# EAGLE board escape (EAGLE 9.5.1)
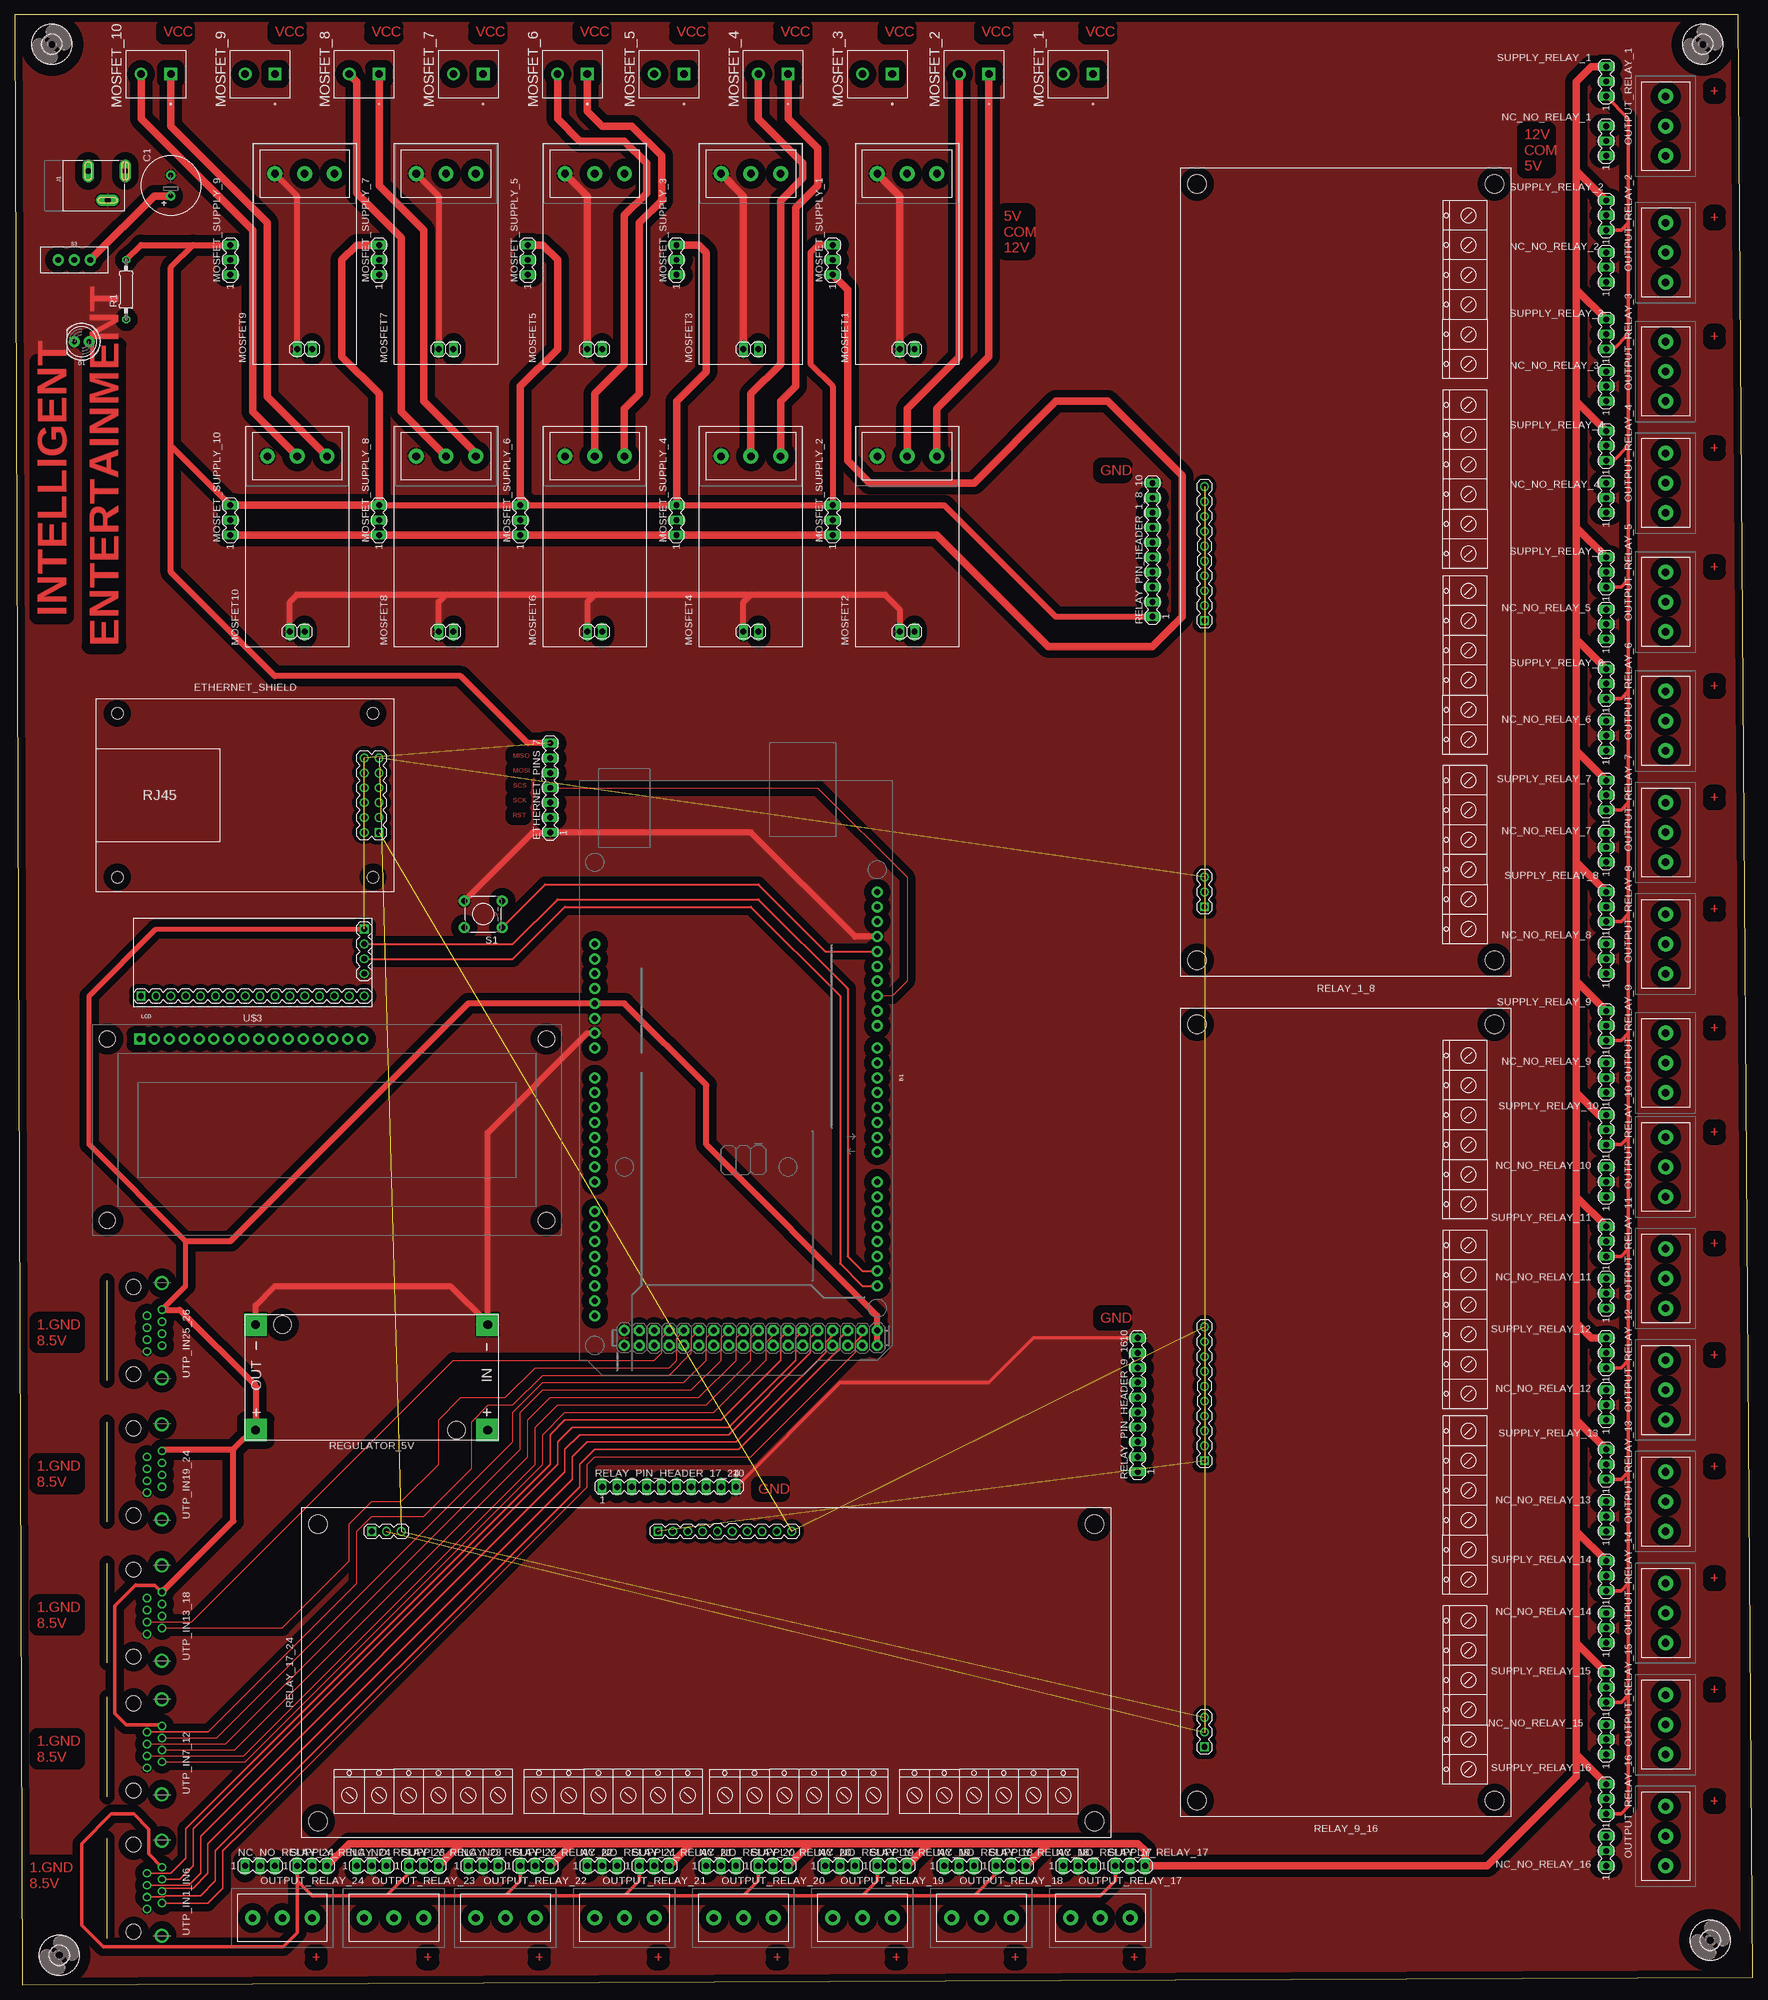
[diagram p5: board, top side]
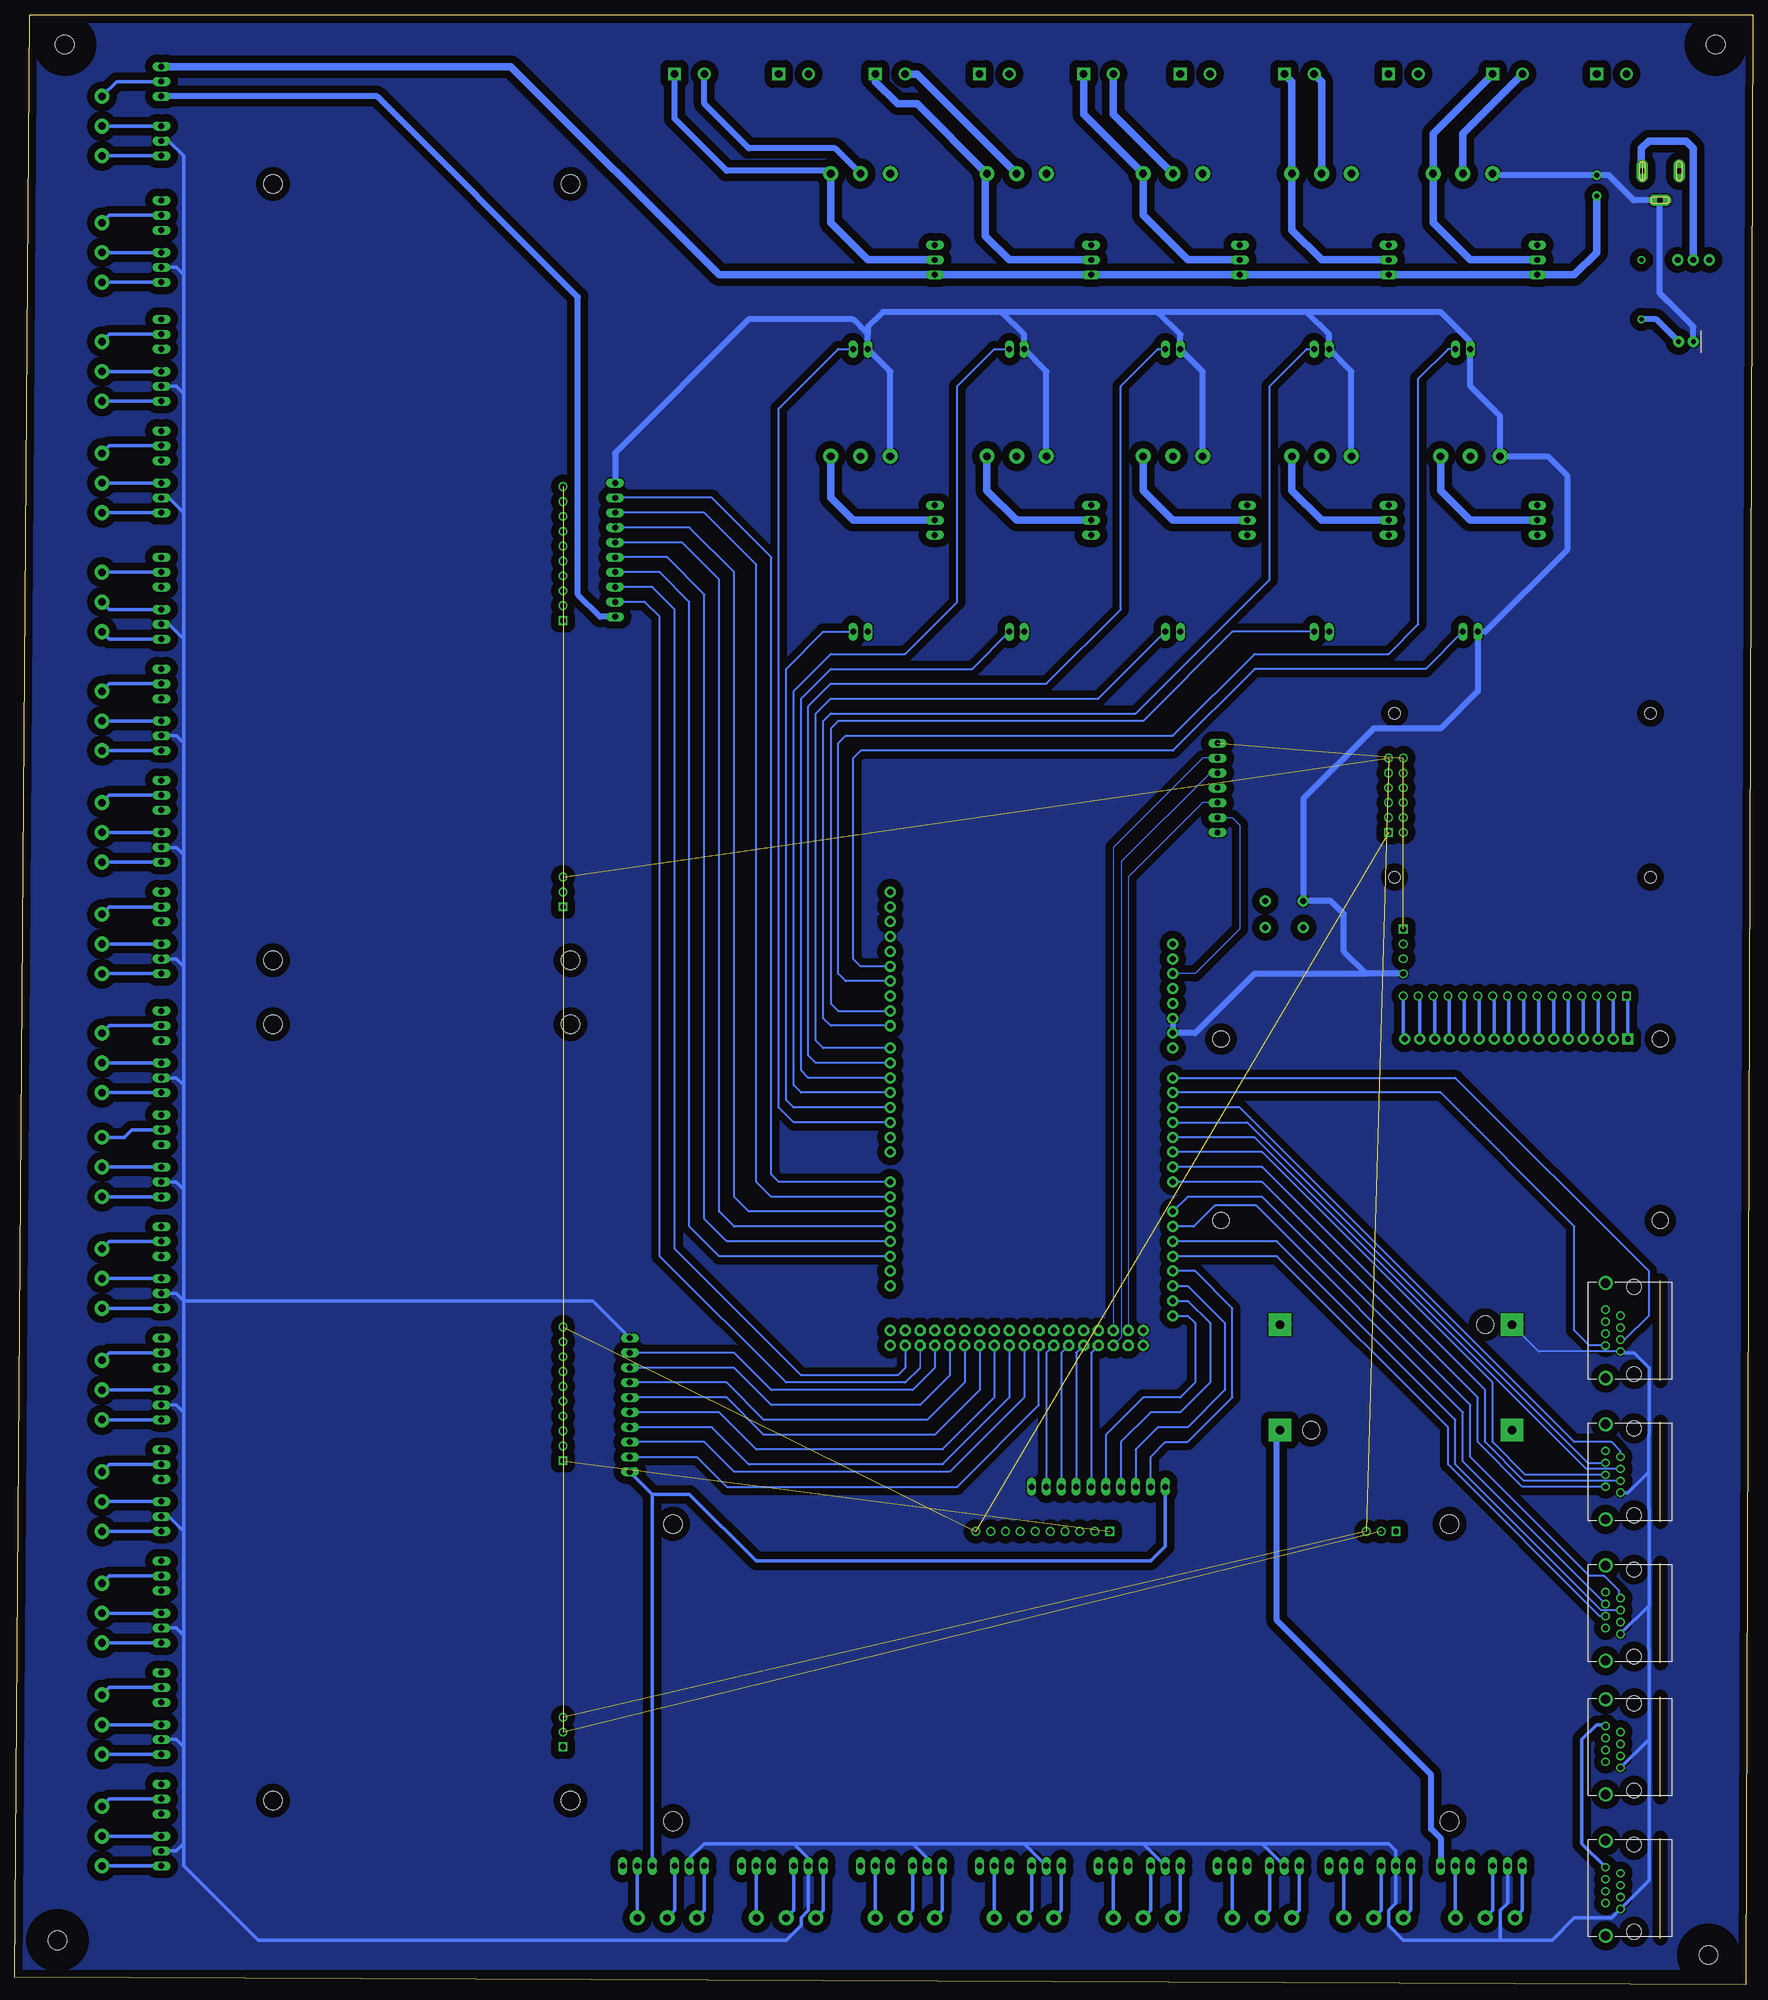
[diagram p6: board, bottom side, seen from below]

Size 296.85 x 336.54 mm. Coordinates in mm from the lower left corner, seen from the top.
Outline: 1.27,0 296.85,1.27 294.31,336.54 0,336.54 1.27,0
Copper layers (1*16): Top 0.035mm / dielectric 1.5mm / Bottom 0.035mm
Design rules "default": minimum track width 6mil, minimum drill 0.35mm, track to track 6mil, track to pad 6mil, pad to pad 6mil, via to via 6mil, smd to smd 6mil, copper to edge 40mil, drill to drill 6mil, minimum pad ring 10mil, minimum via ring 8mil, stop-mask expansion 4mil, vias tented up to drill 0mil, thermal gap 10mil

## Footprints (pad centres in the part's own frame; a part is rotated, then mirrored left to right if it is on the bottom)
ARDUINO_MEGA_NO_SILK = drill 1.016 pad 1.88: 0 13.97,24.13; 1 11.43,24.13; 2 8.89,24.13; 3 6.35,24.13; 3.3V -13.97,-24.13; 4 3.81,24.13; 5 1.27,24.13; 5V -11.43,-24.13; 5V@1 44.45,24.13; 5V@2 46.99,24.13; 6 -1.27,24.13; 7 -3.81,24.13; 8 -7.62,24.13; 9 -10.16,24.13; 10 -12.7,24.13; 11 -15.24,24.13; 12 -17.78,24.13; 13 -20.32,24.13; 14 19.05,24.13; 15 21.59,24.13; 16 24.13,24.13; 17 26.67,24.13; 18 29.21,24.13; 19 31.75,24.13; 20 34.29,24.13; 21 36.83,24.13; A0 1.27,-24.13; A1 3.81,-24.13; A2 6.35,-24.13; A3 8.89,-24.13; A4 11.43,-24.13; A5 13.97,-24.13; A6 16.51,-24.13; A7 19.05,-24.13; A8 24.13,-24.13; A9 26.67,-24.13; A10 29.21,-24.13; A11 31.75,-24.13; A12 34.29,-24.13; A13 36.83,-24.13; A14 39.37,-24.13; A15 41.91,-24.13; AREF -25.4,24.13; GND -8.89,-24.13; GND@1 -6.35,-24.13; GND@2 44.45,-19.05; GND@3 46.99,-19.05; GND@4 -22.86,24.13; IOREF -19.05,-24.13; NC -21.59,-24.13; RESET -16.51,-24.13; SCL -30.48,24.13; SDA -27.94,24.13; VIN -3.81,-24.13 | drill 1.016 pad 1.88 octagon: 22 44.45,21.59; 23 46.99,21.59; 24 44.45,19.05; 25 46.99,19.05; 26 44.45,16.51; 27 46.99,16.51; 28 44.45,13.97; 29 46.99,13.97; 30 44.45,11.43; 31 46.99,11.43; 32 44.45,8.89; 33 46.99,8.89; 34 44.45,6.35; 35 46.99,6.35; 36 44.45,3.81; 37 46.99,3.81; 38 44.45,1.27; 39 46.99,1.27; 40 44.45,-1.27; 41 46.99,-1.27; 42 44.45,-3.81; 43 46.99,-3.81; 44 44.45,-6.35; 45 46.99,-6.35; 46 44.45,-8.89; 47 46.99,-8.89; 48 44.45,-11.43; 49 46.99,-11.43; 50 44.45,-13.97; 51 46.99,-13.97; 52 44.45,-16.51; 53 46.99,-16.51
E3,5-10 = drill 0.813 pad 1.6: + -1.778,0 | drill 0.813 pad 1.6 octagon: - 1.778,0
LED_5MM = drill 0.813 pad 1.88: A -1.27,0; K 1.27,0
MA07-1 = drill 1.016 long: 1 -7.62,0; 2 -5.08,0; 3 -2.54,0; 4 0,0; 5 2.54,0; 6 5.08,0; 7 7.62,0
ETHERNET-ENC28J60 = drill 1 square: 1 22.86,-6.35 | drill 1: 2 20.32,-6.35; 3 22.86,-3.81; 4 20.32,-3.81; 5 22.86,-1.27; 6 20.32,-1.27; 7 22.86,1.27; 8 20.32,1.27; 9 22.86,3.81; 10 20.32,3.81; 11 22.86,6.35; 12 20.32,6.35 | hole 2: -21.844,13.97; 21.844,13.97; -21.844,-13.97; 21.844,-13.97
POWER_JACK_SLOT = drill 1 pad 2 long: GND@1 2.58,7.5; GND@2 7.58,10.8; PWR 2.58,13.8
LCD-16X2_NOSILK = drill 1.016 pad 1.88 square: 1 -32,15.5 | drill 1.016 pad 1.88: 2 -29.46,15.5; 3 -26.92,15.5; 4 -24.38,15.5; 5 -21.84,15.5; 6 -19.3,15.5; 7 -16.76,15.5; 8 -14.22,15.5; 9 -11.68,15.5; 10 -9.14,15.5; 11 -6.6,15.5; 12 -4.06,15.5; 13 -1.52,15.5; 14 1.02,15.5; 15 3.56,15.5; 16 6.1,15.5 | hole 2.8: -37.5,15.5; -37.5,-15.5; 37.5,15.5; 37.5,-15.5
SAMACSYS_PARTS_FR120N-ISOLATED-MOSFET-MOD = drill 1.016 long: 1 2.54,7.62; 2 2.54,10.16 | drill 1.3 pad 2.54: 3 32.512,3.81; 4 32.512,8.89; 5 32.512,13.97
TB006-508-02BE_CUI_TB006-508-02BE = drill 1.3 pad 2.184 square: 1 0,0 | drill 1.3 pad 2.184: 2 5.08,0
MA03-1 = drill 1.016 long: 1 -2.54,0; 2 0,0; 3 2.54,0
SAMACSYS_PARTS_TB00650803BE = drill 1.3 pad 2.54: 1 0,0; 2 5.08,0; 3 10.16,0
0207/10 = drill 0.813 octagon: 1 -5.08,0; 2 5.08,0
DIY-MODULES_DC-DC-STEP-DOWN-LM2596 = drill 1.5 pad 3.81 square: IN+ -19.812,9.398; IN- -19.812,-8.636; OUT+ 19.812,9.398; OUT- 19.812,-8.636 | hole 3: -14.478,9.398; 15.24,-8.636
RELAY-8-SRD = drill 1 square: J1.1 24.13,8.255; J2.1 24.13,57.15 | drill 1: J1.2 24.13,5.715; J1.3 24.13,3.175; J1.4 24.13,0.635; J1.5 24.13,-1.905; J1.6 24.13,-4.445; J1.7 24.13,-6.985; J1.8 24.13,-9.525; J1.9 24.13,-12.065; J1.10 24.13,-14.605; J2.2 24.13,54.61; J2.3 24.13,52.07 | hole 3.2: -25.4,66.294; 25.4,66.294; 25.4,-66.294; -25.4,-66.294
MA10-1 = drill 1.016 long: 1 -11.43,0; 2 -8.89,0; 3 -6.35,0; 4 -3.81,0; 5 -1.27,0; 6 1.27,0; 7 3.81,0; 8 6.35,0; 9 8.89,0; 10 11.43,0
TACTILE-PTH = drill 1.016 pad 1.88: 1 -3.251,2.261; 2 3.251,2.261; 3 -3.251,-2.261; 4 3.251,-2.261
SWITCH_SPDT_PTH_11.6X4.0MM_LOCK = drill 1.016 pad 1.88: 1 0,2.718; 2 0,0; 3 0,-2.718
3,2 = hole 3.2: 0,0
LCD-I2C-CONVERTER = drill 1 square: J1.1 -19.05,-5.08; J2.1 19.05,6.35 | drill 1: J1.2 -19.05,-2.54; J1.3 -19.05,0; J1.4 -19.05,2.54; J2.2 16.51,6.35; J2.3 13.97,6.35; J2.4 11.43,6.35; J2.5 8.89,6.35; J2.6 6.35,6.35; J2.7 3.81,6.35; J2.8 1.27,6.35; J2.9 -1.27,6.35; J2.10 -3.81,6.35; J2.11 -6.35,6.35; J2.12 -8.89,6.35; J2.13 -11.43,6.35; J2.14 -13.97,6.35; J2.15 -16.51,6.35; J2.16 -19.05,6.35
GLX-S-88M = drill 0.9 pad 1.422: 1 -3.57,-2.3; 2 -2.55,-4.84; 3 -1.53,-2.3; 4 -0.51,-4.84; 5 0.51,-2.3; 6 1.53,-4.84; 7 2.55,-2.3; 8 3.57,-4.84 | drill 1.6 pad 2.184: S1 -8.125,-4.84; S2 8.125,-4.84 | hole 2.55: -7.44,0; 7.44,0

## Placement (x,y rotation side)
B1  ARDUINO_MEGA_R3FULL  [ARDUINO_MEGA_NO_SILK]  123.19,156.21 270 top
C1  [E3,5-10]  26.67,307.34 90 top
D1  [LED_5MM]  11.43,280.67 180 top
ETHERNET_PINS  [MA07-1]  91.44,204.47 90 top
ETHERNET_SHIELD  ETHERNET-ENC28J60  [ETHERNET-ENC28J60]  39.37,203.2 0 top
J1  POWER_JACKSLT  [POWER_JACK_SLOT]  5.08,312.42 270 top
LCD  LCD-16X2NOSILK  [LCD-16X2_NOSILK]  53.34,146.05 0 top
MOSFET1  SAMACSYS_PARTS_FR120N-ISOLATED-MOSFET-MOD  [SAMACSYS_PARTS_FR120N-ISOLATED-MOSFET-MOD]  161.29,276.86 90 top
MOSFET2  SAMACSYS_PARTS_FR120N-ISOLATED-MOSFET-MOD  [SAMACSYS_PARTS_FR120N-ISOLATED-MOSFET-MOD]  161.29,228.6 90 top
MOSFET3  SAMACSYS_PARTS_FR120N-ISOLATED-MOSFET-MOD  [SAMACSYS_PARTS_FR120N-ISOLATED-MOSFET-MOD]  134.62,276.86 90 top
MOSFET4  SAMACSYS_PARTS_FR120N-ISOLATED-MOSFET-MOD  [SAMACSYS_PARTS_FR120N-ISOLATED-MOSFET-MOD]  134.62,228.6 90 top
MOSFET5  SAMACSYS_PARTS_FR120N-ISOLATED-MOSFET-MOD  [SAMACSYS_PARTS_FR120N-ISOLATED-MOSFET-MOD]  107.95,276.86 90 top
MOSFET6  SAMACSYS_PARTS_FR120N-ISOLATED-MOSFET-MOD  [SAMACSYS_PARTS_FR120N-ISOLATED-MOSFET-MOD]  107.95,228.6 90 top
MOSFET7  SAMACSYS_PARTS_FR120N-ISOLATED-MOSFET-MOD  [SAMACSYS_PARTS_FR120N-ISOLATED-MOSFET-MOD]  82.55,276.86 90 top
MOSFET8  SAMACSYS_PARTS_FR120N-ISOLATED-MOSFET-MOD  [SAMACSYS_PARTS_FR120N-ISOLATED-MOSFET-MOD]  82.55,228.6 90 top
MOSFET9  SAMACSYS_PARTS_FR120N-ISOLATED-MOSFET-MOD  [SAMACSYS_PARTS_FR120N-ISOLATED-MOSFET-MOD]  58.42,276.86 90 top
MOSFET10  SAMACSYS_PARTS_FR120N-ISOLATED-MOSFET-MOD  [SAMACSYS_PARTS_FR120N-ISOLATED-MOSFET-MOD]  57.15,228.6 90 top
MOSFET_1  TB006-508-02BE_TB006-508-02BE  [TB006-508-02BE_CUI_TB006-508-02BE]  184.15,326.39 180 top
MOSFET_2  TB006-508-02BE_TB006-508-02BE  [TB006-508-02BE_CUI_TB006-508-02BE]  166.37,326.39 180 top
MOSFET_3  TB006-508-02BE_TB006-508-02BE  [TB006-508-02BE_CUI_TB006-508-02BE]  149.86,326.39 180 top
MOSFET_4  TB006-508-02BE_TB006-508-02BE  [TB006-508-02BE_CUI_TB006-508-02BE]  132.08,326.39 180 top
MOSFET_5  TB006-508-02BE_TB006-508-02BE  [TB006-508-02BE_CUI_TB006-508-02BE]  114.3,326.39 180 top
MOSFET_6  TB006-508-02BE_TB006-508-02BE  [TB006-508-02BE_CUI_TB006-508-02BE]  97.79,326.39 180 top
MOSFET_7  TB006-508-02BE_TB006-508-02BE  [TB006-508-02BE_CUI_TB006-508-02BE]  80.01,326.39 180 top
MOSFET_8  TB006-508-02BE_TB006-508-02BE  [TB006-508-02BE_CUI_TB006-508-02BE]  62.23,326.39 180 top
MOSFET_9  TB006-508-02BE_TB006-508-02BE  [TB006-508-02BE_CUI_TB006-508-02BE]  44.45,326.39 180 top
MOSFET_10  TB006-508-02BE_TB006-508-02BE  [TB006-508-02BE_CUI_TB006-508-02BE]  26.67,326.39 180 top
MOSFET_SUPPLY_1  [MA03-1]  139.7,294.64 90 top
MOSFET_SUPPLY_2  [MA03-1]  139.7,250.19 90 top
MOSFET_SUPPLY_3  [MA03-1]  113.03,294.64 90 top
MOSFET_SUPPLY_4  [MA03-1]  113.03,250.19 90 top
MOSFET_SUPPLY_5  [MA03-1]  87.63,294.64 90 top
MOSFET_SUPPLY_6  [MA03-1]  86.36,250.19 90 top
MOSFET_SUPPLY_7  [MA03-1]  62.23,294.64 90 top
MOSFET_SUPPLY_8  [MA03-1]  62.23,250.19 90 top
MOSFET_SUPPLY_9  [MA03-1]  36.83,294.64 90 top
MOSFET_SUPPLY_10  [MA03-1]  36.83,250.19 90 top
NC_NO_RELAY_1  [MA03-1]  271.78,314.96 90 top
NC_NO_RELAY_2  [MA03-1]  271.78,293.37 90 top
NC_NO_RELAY_3  [MA03-1]  271.78,273.05 90 top
NC_NO_RELAY_4  [MA03-1]  271.78,254 90 top
NC_NO_RELAY_5  [MA03-1]  271.78,232.41 90 top
NC_NO_RELAY_6  [MA03-1]  271.78,213.36 90 top
NC_NO_RELAY_7  [MA03-1]  271.78,194.31 90 top
NC_NO_RELAY_8  [MA03-1]  271.78,175.26 90 top
NC_NO_RELAY_9  [MA03-1]  271.78,154.94 90 top
NC_NO_RELAY_10  [MA03-1]  271.78,137.16 90 top
NC_NO_RELAY_11  [MA03-1]  271.78,118.11 90 top
NC_NO_RELAY_12  [MA03-1]  271.78,99.06 90 top
NC_NO_RELAY_13  [MA03-1]  271.78,80.01 90 top
NC_NO_RELAY_14  [MA03-1]  271.78,60.96 90 top
NC_NO_RELAY_15  [MA03-1]  271.78,41.91 90 top
NC_NO_RELAY_16  [MA03-1]  271.78,22.86 90 top
NC_NO_RELAY_17  [MA03-1]  181.61,20.32 0 top
NC_NO_RELAY_18  [MA03-1]  161.29,20.32 0 top
NC_NO_RELAY_19  [MA03-1]  140.97,20.32 0 top
NC_NO_RELAY_20  [MA03-1]  120.65,20.32 0 top
NC_NO_RELAY_21  [MA03-1]  100.33,20.32 0 top
NC_NO_RELAY_22  [MA03-1]  80.01,20.32 0 top
NC_NO_RELAY_23  [MA03-1]  60.96,20.32 0 top
NC_NO_RELAY_24  [MA03-1]  41.91,20.32 0 top
OUTPUT_RELAY_1  SAMACSYS_PARTS_TB006-508-03BE  [SAMACSYS_PARTS_TB00650803BE]  281.94,322.58 270 top
OUTPUT_RELAY_2  SAMACSYS_PARTS_TB006-508-03BE  [SAMACSYS_PARTS_TB00650803BE]  281.94,300.99 270 top
OUTPUT_RELAY_3  SAMACSYS_PARTS_TB006-508-03BE  [SAMACSYS_PARTS_TB00650803BE]  281.94,280.67 270 top
OUTPUT_RELAY_4  SAMACSYS_PARTS_TB006-508-03BE  [SAMACSYS_PARTS_TB00650803BE]  281.94,261.62 270 top
OUTPUT_RELAY_5  SAMACSYS_PARTS_TB006-508-03BE  [SAMACSYS_PARTS_TB00650803BE]  281.94,241.3 270 top
OUTPUT_RELAY_6  SAMACSYS_PARTS_TB006-508-03BE  [SAMACSYS_PARTS_TB00650803BE]  281.94,220.98 270 top
OUTPUT_RELAY_7  SAMACSYS_PARTS_TB006-508-03BE  [SAMACSYS_PARTS_TB00650803BE]  281.94,201.93 270 top
OUTPUT_RELAY_8  SAMACSYS_PARTS_TB006-508-03BE  [SAMACSYS_PARTS_TB00650803BE]  281.94,182.88 270 top
OUTPUT_RELAY_9  SAMACSYS_PARTS_TB006-508-03BE  [SAMACSYS_PARTS_TB00650803BE]  281.94,162.56 270 top
OUTPUT_RELAY_10  SAMACSYS_PARTS_TB006-508-03BE  [SAMACSYS_PARTS_TB00650803BE]  281.94,144.78 270 top
OUTPUT_RELAY_11  SAMACSYS_PARTS_TB006-508-03BE  [SAMACSYS_PARTS_TB00650803BE]  281.94,125.73 270 top
OUTPUT_RELAY_12  SAMACSYS_PARTS_TB006-508-03BE  [SAMACSYS_PARTS_TB00650803BE]  281.94,106.68 270 top
OUTPUT_RELAY_13  SAMACSYS_PARTS_TB006-508-03BE  [SAMACSYS_PARTS_TB00650803BE]  281.94,87.63 270 top
OUTPUT_RELAY_14  SAMACSYS_PARTS_TB006-508-03BE  [SAMACSYS_PARTS_TB00650803BE]  281.94,68.58 270 top
OUTPUT_RELAY_15  SAMACSYS_PARTS_TB006-508-03BE  [SAMACSYS_PARTS_TB00650803BE]  281.94,49.53 270 top
OUTPUT_RELAY_16  SAMACSYS_PARTS_TB006-508-03BE  [SAMACSYS_PARTS_TB00650803BE]  281.94,30.48 270 top
OUTPUT_RELAY_17  SAMACSYS_PARTS_TB006-508-03BE  [SAMACSYS_PARTS_TB00650803BE]  190.5,11.43 180 top
OUTPUT_RELAY_18  SAMACSYS_PARTS_TB006-508-03BE  [SAMACSYS_PARTS_TB00650803BE]  170.18,11.43 180 top
OUTPUT_RELAY_19  SAMACSYS_PARTS_TB006-508-03BE  [SAMACSYS_PARTS_TB00650803BE]  149.86,11.43 180 top
OUTPUT_RELAY_20  SAMACSYS_PARTS_TB006-508-03BE  [SAMACSYS_PARTS_TB00650803BE]  129.54,11.43 180 top
OUTPUT_RELAY_21  SAMACSYS_PARTS_TB006-508-03BE  [SAMACSYS_PARTS_TB00650803BE]  109.22,11.43 180 top
OUTPUT_RELAY_22  SAMACSYS_PARTS_TB006-508-03BE  [SAMACSYS_PARTS_TB00650803BE]  88.9,11.43 180 top
OUTPUT_RELAY_23  SAMACSYS_PARTS_TB006-508-03BE  [SAMACSYS_PARTS_TB00650803BE]  69.85,11.43 180 top
OUTPUT_RELAY_24  SAMACSYS_PARTS_TB006-508-03BE  [SAMACSYS_PARTS_TB00650803BE]  50.8,11.43 180 top
R1  220  [0207/10]  19.05,289.56 90 top
REGULATOR_5V  DIY-MODULES_DC-DC-STEP-DOWN-LM2596  [DIY-MODULES_DC-DC-STEP-DOWN-LM2596]  60.96,104.14 180 top
RELAY_1_8  RELAY-8-SRD  [RELAY-8-SRD]  227.33,241.3 180 top
RELAY_9_16  RELAY-8-SRD  [RELAY-8-SRD]  227.33,97.79 180 top
RELAY_17_24  RELAY-8-SRD  [RELAY-8-SRD]  118.11,53.34 90 top
RELAY_PIN_HEADER_1_8  [MA10-1]  194.31,245.11 90 top
RELAY_PIN_HEADER_9_16  [MA10-1]  191.77,99.06 90 top
RELAY_PIN_HEADER_17_24  [MA10-1]  111.76,85.09 0 top
S1  [TACTILE-PTH]  80.01,182.88 180 top
S3  [SWITCH_SPDT_PTH_11.6X4.0MM_LOCK]  10.16,294.64 270 top
SUPPLY_RELAY_1  [MA03-1]  271.78,325.12 90 top
SUPPLY_RELAY_2  [MA03-1]  271.78,302.26 90 top
SUPPLY_RELAY_3  [MA03-1]  271.78,281.94 90 top
SUPPLY_RELAY_4  [MA03-1]  271.78,262.89 90 top
SUPPLY_RELAY_5  [MA03-1]  271.78,241.3 90 top
SUPPLY_RELAY_6  [MA03-1]  271.78,222.25 90 top
SUPPLY_RELAY_7  [MA03-1]  271.78,203.2 90 top
SUPPLY_RELAY_8  [MA03-1]  271.78,184.15 90 top
SUPPLY_RELAY_9  [MA03-1]  271.78,163.83 90 top
SUPPLY_RELAY_10  [MA03-1]  271.78,146.05 90 top
SUPPLY_RELAY_11  [MA03-1]  271.78,127 90 top
SUPPLY_RELAY_12  [MA03-1]  271.78,107.95 90 top
SUPPLY_RELAY_13  [MA03-1]  271.78,88.9 90 top
SUPPLY_RELAY_14  [MA03-1]  271.78,69.85 90 top
SUPPLY_RELAY_15  [MA03-1]  271.78,50.8 90 top
SUPPLY_RELAY_16  [MA03-1]  271.78,31.75 90 top
SUPPLY_RELAY_17  [MA03-1]  190.5,20.32 0 top
SUPPLY_RELAY_18  [MA03-1]  170.18,20.32 0 top
SUPPLY_RELAY_19  [MA03-1]  149.86,20.32 0 top
SUPPLY_RELAY_20  [MA03-1]  129.54,20.32 0 top
SUPPLY_RELAY_21  [MA03-1]  109.22,20.32 0 top
SUPPLY_RELAY_22  [MA03-1]  88.9,20.32 0 top
SUPPLY_RELAY_23  [MA03-1]  69.85,20.32 0 top
SUPPLY_RELAY_24  [MA03-1]  50.8,20.32 0 top
U$1  [3,2]  289.56,7.62 0 top
U$2  [3,2]  7.62,5.08 0 top
U$3  LCD-I2C-CONVERTER  [LCD-I2C-CONVERTER]  40.64,175.26 180 top
U$4  [3,2]  6.35,331.47 0 top
U$5  [3,2]  288.29,331.47 0 top
UTP_IN1_IN6  GLX-S-88M  [GLX-S-88M]  20.32,16.51 90 top
UTP_IN7_12  GLX-S-88M  [GLX-S-88M]  20.32,40.64 90 top
UTP_IN13_18  GLX-S-88M  [GLX-S-88M]  20.32,63.5 90 top
UTP_IN19_24  GLX-S-88M  [GLX-S-88M]  20.32,87.63 90 top
UTP_IN25_26  GLX-S-88M  [GLX-S-88M]  20.32,111.76 90 top

## Tracks (layer width: path | path; a pad name or v marks a point on that pad's centre or on a via)
5V  (2 unrouted)
  Top 0.305: MOSFET_SUPPLY_4.3 111.76,252.73 | 138.43,297.18 MOSFET_SUPPLY_1.3 | MOSFET_SUPPLY_7.3 60.96,297.18
  Top 0.61: SUPPLY_RELAY_1.1 275.59,318.77 275.59,300.99 | 275.59,300.99 274.32,299.72 SUPPLY_RELAY_2.1 | SUPPLY_RELAY_3.1 273.05,279.4 275.59,281.94 | 275.59,281.94 275.59,300.99 | SUPPLY_RELAY_4.1 273.05,260.35 275.59,262.89 | 275.59,262.89 275.59,281.94 | SUPPLY_RELAY_5.1 274.32,238.76 275.59,240.03 | 275.59,240.03 275.59,262.89 | SUPPLY_RELAY_6.1 274.32,219.71 275.59,220.98 | 275.59,220.98 275.59,240.03 | SUPPLY_RELAY_7.1 274.32,200.66 275.59,201.93 | 275.59,201.93 275.59,220.98 | SUPPLY_RELAY_8.1 274.32,181.61 275.59,182.88 | 275.59,182.88 275.59,201.93 | SUPPLY_RELAY_9.1 274.32,161.29 275.59,162.56 | 275.59,162.56 275.59,182.88 | SUPPLY_RELAY_10.1 274.32,143.51 275.59,144.78 | 275.59,144.78 275.59,162.56 | SUPPLY_RELAY_11.1 274.32,124.46 275.59,125.73 | 275.59,125.73 275.59,144.78 | SUPPLY_RELAY_12.1 274.32,105.41 275.59,106.68 | 275.59,106.68 275.59,125.73 | SUPPLY_RELAY_13.1 274.32,86.36 275.59,87.63 | 275.59,87.63 275.59,106.68 | SUPPLY_RELAY_14.1 274.32,67.31 275.59,68.58 | 275.59,68.58 275.59,87.63 | SUPPLY_RELAY_15.1 274.32,48.26 275.59,49.53 | 275.59,49.53 275.59,68.58 | SUPPLY_RELAY_16.1 274.32,29.21 275.59,30.48 275.59,49.53 | 63.5,15.24 50.8,15.24 48.26,17.78 SUPPLY_RELAY_24.1 48.26,8.89 45.84,6.47 15.12,6.47 11.43,10.16 11.43,24.13 16.51,29.21 20.32,29.21 22.92,26.61 22.92,22.88 22.88,22.84 22.88,22.36 UTP_IN1_IN6.8 | 63.5,15.24 67.31,19.05 SUPPLY_RELAY_23.1 | 63.5,15.24 83.82,15.24 | 83.82,15.24 86.36,17.78 SUPPLY_RELAY_22.1 | 83.82,15.24 104.14,15.24 | 104.14,15.24 106.68,17.78 SUPPLY_RELAY_21.1 | 104.14,15.24 124.46,15.24 | 124.46,15.24 127,17.78 SUPPLY_RELAY_20.1 | 124.46,15.24 144.78,15.24
  Top 0.61: 144.78,15.24 147.32,17.78 SUPPLY_RELAY_19.1 | 144.78,15.24 163.83,15.24 | 163.83,15.24 167.64,19.05 SUPPLY_RELAY_18.1 | 163.83,15.24 185.42,15.24 187.96,17.78 SUPPLY_RELAY_17.1 | 41.15,95.25 REGULATOR_5V.OUT+ | 20.7,68.34 20.62,68.27 | 20.62,68.27 17.12,64.77 17.12,46.38 19.05,44.45 25.4,44.45 UTP_IN7_12.8 | 20.62,68.27 23.95,68.27 UTP_IN13_18.8
  Top 0.813: UTP_IN25_26.8 29.21,119.38 29.21,127 12.7,143.51 12.7,168.91 24.13,180.34 U$3.J1.1
  Top 1.016: R1.2 21.59,297.18 30.48,297.18 | 30.48,297.18 MOSFET_SUPPLY_9.3 | MOSFET_SUPPLY_10.3 26.67,262.89 | 26.67,262.89 26.67,293.37 30.48,297.18 | ETHERNET_PINS.7 87.63,212.09 76.2,223.52 44.45,223.52 26.67,241.3 26.67,262.89 | MOSFET_SUPPLY_8.3 MOSFET_SUPPLY_6.3 87.63,252.73 MOSFET_SUPPLY_4.3 MOSFET_SUPPLY_2.3 | MOSFET_SUPPLY_2.3 158.75,252.73 177.8,233.68 RELAY_PIN_HEADER_1_8.1 | MOSFET_SUPPLY_1.3 137.16,297.18 135.89,295.91 135.89,276.86 139.7,273.05 MOSFET_SUPPLY_2.3 | UTP_IN19_24.8 25.4,91.44 37.34,91.44 | 37.34,91.44 41.15,95.25 41.15,102.36 28.18,115.33 UTP_IN25_26.8 | UTP_IN13_18.8 37.34,79.25 37.34,91.44 | 29.21,127 36.83,127 77.47,167.64 B1.5V 104.14,167.64 118.11,153.67 118.11,143.51 147.32,114.3 B1.5V@1 B1.5V@2
  Top 1.27: MOSFET_SUPPLY_3.3 116.84,297.18 118.11,295.91 118.11,275.59 113.03,270.51 MOSFET_SUPPLY_4.3 | MOSFET_SUPPLY_5.3 90.17,297.18 92.71,294.64 92.71,279.4 86.36,273.05 86.36,254 87.63,252.73 | MOSFET_SUPPLY_7.3 58.42,297.18 55.88,294.64 55.88,278.13 62.23,271.78 MOSFET_SUPPLY_8.3 MOSFET_SUPPLY_10.3
  Bottom 0.61: UTP_IN1_IN6.8 29.21,24.13 29.21,41.91 26.67,44.45 25.4,44.45 UTP_IN7_12.8 | SUPPLY_RELAY_17.1 187.96,83.82 | 187.96,83.82 RELAY_PIN_HEADER_9_16.1 | RELAY_PIN_HEADER_17_24.1 100.33,74.93 102.87,72.39 170.18,72.39 181.61,83.82 187.96,83.82
  Bottom 1.016: RELAY_PIN_HEADER_1_8.1 196.85,233.68 200.66,237.49 200.66,288.29 234.95,322.58 SUPPLY_RELAY_1.1
12V
  Top 0.61: 193.04,21.59 SUPPLY_RELAY_17.3
  Top 1.27: S3.1 23.8,305.56 C1.+ | MOSFET_SUPPLY_10.1 MOSFET_SUPPLY_8.1 MOSFET_SUPPLY_6.1 MOSFET_SUPPLY_4.1 MOSFET_SUPPLY_2.1 157.48,247.65 176.53,228.6 194.31,228.6 199.39,233.68 199.39,257.81 186.69,270.51 177.8,270.51 163.83,256.54 146.05,256.54 142.24,260.35 142.24,289.56 MOSFET_SUPPLY_1.1 | SUPPLY_RELAY_1.3 269.24,327.66 266.7,325.12 266.7,309.88 | 266.7,309.88 SUPPLY_RELAY_2.3 | SUPPLY_RELAY_3.3 266.7,289.56 | 266.7,289.56 266.7,309.88 | SUPPLY_RELAY_4.3 266.7,270.51 | 266.7,270.51 266.7,289.56 | SUPPLY_RELAY_5.3 266.7,248.92 | 266.7,248.92 266.7,270.51 | SUPPLY_RELAY_6.3 266.7,229.87 | 266.7,229.87 266.7,248.92 | SUPPLY_RELAY_7.3 266.7,210.82 | 266.7,210.82 266.7,229.87 | SUPPLY_RELAY_8.3 266.7,191.77 | 266.7,191.77 266.7,210.82 | SUPPLY_RELAY_9.3 266.7,171.45 | 266.7,171.45 266.7,191.77 | SUPPLY_RELAY_10.3 270.51,148.59 266.7,152.4 | 266.7,152.4 266.7,171.45 | SUPPLY_RELAY_11.3 266.7,134.62 | 266.7,134.62 266.7,152.4 | SUPPLY_RELAY_12.3 269.24,110.49 266.7,113.03 | 266.7,113.03 266.7,134.62 | SUPPLY_RELAY_13.3 266.7,96.52 | 266.7,96.52 266.7,113.03 | SUPPLY_RELAY_14.3 266.7,77.47 | 266.7,77.47 266.7,96.52 | SUPPLY_RELAY_15.3 266.7,58.42 | 266.7,58.42 266.7,77.47 | SUPPLY_RELAY_16.3 266.7,39.37 | 266.7,39.37 266.7,58.42 | 266.7,39.37 266.7,35.56 251.46,20.32 SUPPLY_RELAY_17.3 193.04,22.86 191.77,24.13 176.53,24.13 | SUPPLY_RELAY_18.3 176.53,24.13 | SUPPLY_RELAY_19.3 156.21,24.13 | 156.21,24.13 176.53,24.13 | SUPPLY_RELAY_21.3 115.57,24.13 | 115.57,24.13 135.89,24.13 | 135.89,24.13 156.21,24.13 | SUPPLY_RELAY_20.3 135.89,24.13 | SUPPLY_RELAY_22.3 95.25,24.13 | 95.25,24.13 115.57,24.13 | SUPPLY_RELAY_23.3 76.2,24.13
  Top 1.27: 76.2,24.13 95.25,24.13 | SUPPLY_RELAY_24.3 57.15,24.13 76.2,24.13
  Bottom 1.016: REGULATOR_5V.IN+ 81.28,94.23 81.28,62.23 54.94,35.89 54.94,26.65 53.34,25.05 SUPPLY_RELAY_24.3
  Bottom 1.27: C1.+ 26.67,295.91 30.48,292.1 MOSFET_SUPPLY_9.1 MOSFET_SUPPLY_7.1 MOSFET_SUPPLY_5.1 MOSFET_SUPPLY_3.1 MOSFET_SUPPLY_1.1 176.53,292.1 212.09,327.66 SUPPLY_RELAY_1.3
GND
  Top 0.61: REGULATOR_5V.IN- 80.77,113.03 | RELAY_PIN_HEADER_17_24.10 140.97,102.87 166.37,102.87 173.99,110.49 RELAY_PIN_HEADER_9_16.10
  Top 1.016: MOSFET9.2 48.26,305.56 MOSFET9.5 | MOSFET10.2 46.99,236.22 48.26,237.49 73.66,237.49 | 73.66,237.49 99.06,237.49 | 99.06,237.49 125.73,237.49 | 125.73,237.49 148.59,237.49 151.13,234.95 MOSFET2.2 | MOSFET8.2 72.39,236.22 73.66,237.49 | 99.06,237.49 97.79,236.22 MOSFET6.2 | 125.73,237.49 124.46,236.22 MOSFET4.2 | S1.4 88.47,196.85 ETHERNET_PINS.1 125.73,196.85 143.51,179.07 B1.GND@4 | MOSFET7.5 72.39,305.56 MOSFET7.2 | REGULATOR_5V.OUT- 41.15,116.08 44.45,119.38 74.42,119.38 80.77,113.03 | REGULATOR_5V.IN- 80.77,145.54 97.79,162.56 B1.GND@1
  Top 1.27: MOSFET5.5 97.79,305.56 MOSFET5.2 | MOSFET3.5 124.46,305.56 MOSFET3.2 | MOSFET1.5 151.13,305.56 MOSFET1.2
  Bottom 0.305: 22.86,108.19 36.56,108.19 REGULATOR_5V.OUT-
  Bottom 0.61: NC_NO_RELAY_17.2 181.61,21.59 179.07,24.13 163.83,24.13 | 163.83,24.13 161.29,21.59 NC_NO_RELAY_18.2 161.29,12.7 162.56,11.43 162.56,10.16 165.1,7.62 255.27,7.62 267.97,20.32 267.97,24.13 | NC_NO_RELAY_19.2 140.97,21.59 143.51,24.13 | 143.51,24.13 163.83,24.13 | NC_NO_RELAY_16.2 269.24,22.86 267.97,24.13 | 267.97,24.13 267.97,40.64 | 267.97,40.64 269.24,41.91 NC_NO_RELAY_15.2 | NC_NO_RELAY_14.2 269.24,60.96 267.97,59.69 | 267.97,59.69 267.97,40.64 | NC_NO_RELAY_13.2 270.51,80.01 267.97,77.47 | 267.97,77.47 267.97,59.69 | NC_NO_RELAY_12.2 269.24,99.06 267.97,97.79 | 267.97,97.79 267.97,77.47 | NC_NO_RELAY_11.2 269.24,118.11 267.97,116.84 | 267.97,116.84 267.97,97.79 | NC_NO_RELAY_20.2 124.46,24.13 | 124.46,24.13 143.51,24.13 | NC_NO_RELAY_21.2 104.14,24.13 | 104.14,24.13 124.46,24.13 | NC_NO_RELAY_22.2 83.82,24.13 | 83.82,24.13 104.14,24.13 | 83.82,24.13 62.23,24.13 60.96,22.86 NC_NO_RELAY_23.2 60.96,13.97 62.23,12.7 62.23,10.16 59.69,7.62 43.18,7.62 | NC_NO_RELAY_10.2 269.24,137.16 267.97,135.89 | 267.97,135.89 267.97,116.84 | NC_NO_RELAY_9.2 269.24,154.94 267.97,153.67 | 267.97,153.67 267.97,135.89 | NC_NO_RELAY_8.2 269.24,175.26 267.97,173.99 | 267.97,173.99 267.97,153.67 | NC_NO_RELAY_7.2 269.24,194.31 267.97,193.04 | 267.97,193.04 267.97,173.99 | NC_NO_RELAY_6.2 269.24,213.36 267.97,212.09 | 267.97,212.09 267.97,193.04 | NC_NO_RELAY_5.2 270.51,232.41 267.97,229.87 | 267.97,229.87 267.97,212.09 | NC_NO_RELAY_4.2 270.51,254 267.97,251.46 | 267.97,251.46 267.97,229.87 | NC_NO_RELAY_3.2 269.24,273.05 267.97,271.78 | 267.97,271.78 267.97,251.46 | NC_NO_RELAY_2.2 269.24,293.37 267.97,292.1 | 267.97,292.1 267.97,271.78
  Bottom 0.61: NC_NO_RELAY_1.2 270.51,314.96 267.97,312.42 267.97,292.1 | 22.86,108.19 UTP_IN25_26.1 22.38,107.95 20.28,107.95 17.72,105.39 17.72,93.99 17.78,93.94 17.78,87.63 | 17.78,87.63 21.35,84.06 UTP_IN19_24.1 | 17.78,87.63 17.78,81.32 17.72,81.27 17.72,64.83 17.78,64.77 | 17.78,64.77 UTP_IN13_18.1 | 17.78,64.77 17.78,57.19 17.72,57.13 17.72,41.97 | UTP_IN7_12.1 17.72,41.97 | 17.72,41.97 17.72,17.84 UTP_IN1_IN6.1 24.13,11.43 30.48,11.43 34.29,7.62 43.18,7.62 | 43.18,7.62 43.18,12.7 41.91,13.97 NC_NO_RELAY_24.2 | RELAY_PIN_HEADER_9_16.10 198.12,116.84 267.97,116.84
  Bottom 1.016: 76.2,285.75 53.34,285.75 48.26,280.67 MOSFET9.2 48.26,273.05 43.18,267.97 MOSFET10.5 35.05,261.11 31.75,257.81 31.75,245.11 45.72,231.14 MOSFET10.2 46.99,220.98 53.34,214.63 64.77,214.63 76.76,202.64 S1.4 72.11,185.14 69.85,182.88 69.85,176.53 66.04,172.72 | 76.2,285.75 101.6,285.75 | 101.6,285.75 128.27,285.75 | 128.27,285.75 148.59,285.75 151.13,283.21 151.13,281.94 | 76.2,285.75 72.39,281.94 MOSFET7.2 68.58,275.59 MOSFET8.5 | 101.6,285.75 97.79,281.94 MOSFET5.2 93.98,275.59 MOSFET6.5 | 128.27,285.75 124.46,281.94 MOSFET3.2 120.65,275.59 MOSFET4.5 | MOSFET2.5 147.32,275.59 MOSFET1.2 151.13,281.94 | 151.13,281.94 153.67,284.48 171.45,284.48 194.31,261.62 RELAY_PIN_HEADER_1_8.10 | D1.K 10.16,283.21 15.88,288.93 J1.GND@2 20.36,304.84 24.64,309.12 C1.- 44.2,309.12 MOSFET9.5 | U$3.J1.4 66.04,172.72 | 66.04,172.72 85.09,172.72 95.25,162.56 B1.GND@1 B1.GND
  pour Top (isolate 1.27): 294.64,336.55 0,336.55 0,335.28 0,0 6.35,0 294.64,0
  pour Bottom (isolate 1.27): 293.37,335.28 1.27,335.28 1.27,275.59 1.27,2.54 295.91,2.54 295.91,335.28
GND.1  (3 unrouted)
GND.2  (3 unrouted)
IN1
  Top 0.203: 39.37,26.67 97.79,85.09 97.79,88.9 99.06,90.17 125.73,90.17 143.56,108
  Top 0.254: B1.22 144.78,110.94 143.56,109.72 143.56,108 | 39.37,26.67 35.56,22.86 35.56,16.51 33.01,13.96 UTP_IN1_IN6.2
IN2
  Top 0.254: UTP_IN1_IN6.3 22.65,15.01 25.57,15.01 25.8,15.24 31.75,15.24 34.29,17.78 34.29,22.86 96.52,85.09 96.52,88.9 99.06,91.44 123.64,91.44 140.92,108.71 140.92,110.44 B1.24
IN3
  Top 0.254: UTP_IN1_IN6.4 25.67,16.51 30.48,16.51 33.02,19.05 33.02,24.13 95.25,86.36 95.25,90.17 97.79,92.71 123.19,92.71 138.48,108 138.48,109.72 139.7,110.94 B1.26
IN4
  Top 0.254: UTP_IN1_IN6.5 29.72,17.02 31.75,19.05 31.75,25.4 93.98,87.63 93.98,91.44 96.52,93.98 121.92,93.98 135.89,107.95 135.89,110.49 B1.28
IN5
  Top 0.254: UTP_IN1_IN6.6 28.2,18.04 30.48,20.32 30.48,26.67 92.71,88.9 92.71,92.71 95.25,95.25 121.92,95.25 133.35,106.68 133.35,110.49 B1.30
IN6
  Top 0.254: UTP_IN1_IN6.7 26.66,19.06 26.67,19.05 29.21,21.59 29.21,26.67 91.44,88.9 91.44,93.98 93.98,96.52 120.65,96.52 130.81,106.68 130.81,110.49 B1.32
IN7
  Top 0.203: UTP_IN7_12.2 33.01,38.09 33.02,38.1 39.37,38.1 90.17,88.9 90.17,93.98 93.98,97.79 119.38,97.79 128.35,106.76 128.35,109.71 129.54,110.91 B1.34
IN8
  Top 0.203: UTP_IN7_12.3 39.11,39.11 88.9,88.9 88.9,95.25 92.71,99.06 118.11,99.06 125.73,106.68 125.73,110.49 B1.36
IN9
  Top 0.203: UTP_IN7_12.4 37.59,40.13 87.63,90.17 87.63,96.52 91.44,100.33 116.84,100.33 123.19,106.68 123.19,110.49 B1.38
IN10
  Top 0.203: UTP_IN7_12.5 36.07,41.15 86.36,91.44 86.36,97.79 90.17,101.6 115.57,101.6 120.65,106.68 120.65,110.49 B1.40
IN11
  Top 0.203: UTP_IN7_12.6 34.55,42.17 85.09,92.71 85.09,97.79 90.17,102.87 114.3,102.87 118.11,106.68 118.11,110.49 B1.42
IN12
  Top 0.203: 33.02,43.18 58.42,68.58 58.42,77.47 60.96,80.01 69.85,80.01 78.06,88.22 78.06,96.19 80.92,99.06 85.09,99.06 90.17,104.14 111.76,104.14 115.57,107.95 115.57,110.49 B1.44
  Top 0.254: 33.02,43.18 33.01,43.19 UTP_IN7_12.7
IN13
  Top 0.203: UTP_IN13_18.2 45.71,60.95 57.15,72.39 57.15,78.74 60.96,82.55 66.04,82.55 72.39,88.9 72.39,96.52 76.2,100.33 83.82,100.33 88.9,105.41 111.76,105.41 113.03,106.68 113.03,110.49 B1.46
IN14
  Top 0.203: UTP_IN13_18.3 30.22,61.97 74.93,106.68 109.22,106.68 110.49,107.95 110.49,110.49 B1.48
IN15
  Bottom 0.305: UTP_IN13_18.4 26.16,62.99 52.07,88.9 52.07,95.25 81.28,124.46 B1.A11
IN16
  Bottom 0.305: UTP_IN13_18.5 25.91,64.01 50.8,88.9 50.8,96.52 81.28,127 B1.A10
IN17
  Bottom 0.305: UTP_IN13_18.6 49.53,89.4 49.53,97.79 84.86,133.12 91.9,133.12 95.48,129.54 B1.A9
IN18
  Bottom 0.305: UTP_IN13_18.7 22.86,66.29 22.86,67.31 25.4,69.85 27.94,69.85 48.26,90.17 48.26,99.06 83.82,134.62 96.52,134.62 B1.A8
IN19
  Bottom 0.305: UTP_IN19_24.2 38.09,85.08 38.1,85.09 39.37,85.09 46.99,92.71 46.99,100.33 83.82,137.16 B1.A7
IN20
  Bottom 0.305: UTP_IN19_24.3 39.11,86.1 45.72,92.71 45.72,101.6 83.82,139.7 B1.A6
IN21
  Bottom 0.305: UTP_IN19_24.4 38.86,87.12 44.45,92.71 44.45,102.87 83.82,142.24 B1.A5
IN22
  Bottom 0.305: UTP_IN19_24.5 28.45,88.14 85.09,144.78 B1.A4
IN23
  Bottom 0.305: B1.A3 86.36,147.32 28.2,89.16 UTP_IN19_24.6
IN24
  Bottom 0.305: UTP_IN19_24.7 22.62,91.2 24.13,92.71 30.48,92.71 87.63,149.86 B1.A2
IN25
  Bottom 0.305: UTP_IN25_26.2 27.94,109.22 30.48,111.76 30.48,129.54 53.34,152.4 B1.A1
IN26
  Bottom 0.305: UTP_IN25_26.3 21.85,110.23 17.78,114.3 17.78,121.92 50.8,154.94 B1.A0
MISO
  Bottom 0.203: ETHERNET_PINS.6 93.98,209.55 109.22,194.31 B1.50
MOSI
  Bottom 0.203: B1.51 107.87,110.57 107.87,191.85 92.71,207.01 ETHERNET_PINS.5
N$1
  Bottom 0.61: SUPPLY_RELAY_1.2 279.4,325.12 OUTPUT_RELAY_1.1
N$2
  Bottom 1.016: D1.A 16.51,284.48 R1.1
N$3
  Bottom 0.61: OUTPUT_RELAY_2.1 280.67,302.26 SUPPLY_RELAY_2.2
N$4
  Bottom 0.61: OUTPUT_RELAY_1.2 NC_NO_RELAY_1.3
N$5
  Bottom 0.61: OUTPUT_RELAY_1.3 NC_NO_RELAY_1.1
N$6
  Bottom 0.61: OUTPUT_RELAY_2.2 NC_NO_RELAY_2.3
N$7
  Bottom 0.61: OUTPUT_RELAY_2.3 NC_NO_RELAY_2.1
N$8
  Bottom 0.61: SUPPLY_RELAY_3.2 280.67,281.94 OUTPUT_RELAY_3.1
N$9
  Bottom 0.61: NC_NO_RELAY_3.3 OUTPUT_RELAY_3.2
N$10
  Bottom 0.61: OUTPUT_RELAY_3.3 NC_NO_RELAY_3.1
N$11
  Bottom 0.61: U$3.J2.16 59.69,161.8 LCD.16
N$12
  Bottom 0.61: LCD.15 56.9,168.66 U$3.J2.15
N$13
  Bottom 0.61: LCD.14 54.36,168.66 U$3.J2.14
N$14
  Bottom 0.61: LCD.13 51.82,168.66 U$3.J2.13
N$15
  Bottom 0.61: LCD.12 49.28,168.66 U$3.J2.12
N$16
  Bottom 0.61: LCD.11 46.74,168.66 U$3.J2.11
N$17
  Bottom 0.61: LCD.10 44.2,168.66 U$3.J2.10
N$18
  Bottom 0.61: LCD.9 41.66,168.66 U$3.J2.9
N$19
  Bottom 0.61: LCD.8 39.12,168.66 U$3.J2.8
N$20
  Bottom 0.61: LCD.7 36.58,168.66 U$3.J2.7
N$21
  Bottom 0.61: LCD.6 34.04,168.66 U$3.J2.6
N$22
  Bottom 0.61: LCD.5 31.5,168.66 U$3.J2.5
N$23
  Bottom 0.61: LCD.4 28.96,168.66 U$3.J2.4
N$24
  Bottom 0.61: LCD.3 26.42,168.66 U$3.J2.3
N$25
  Bottom 0.61: LCD.2 23.88,168.66 U$3.J2.2
N$26
  Bottom 0.61: LCD.1 21.34,168.66 U$3.J2.1
N$27
  Bottom 0.61: SUPPLY_RELAY_9.2 280.67,163.83 OUTPUT_RELAY_9.1
N$28
  Bottom 0.61: SUPPLY_RELAY_4.2 280.67,262.89 OUTPUT_RELAY_4.1
N$29
  Bottom 0.61: OUTPUT_RELAY_9.2 NC_NO_RELAY_9.3
N$30
  Bottom 0.61: OUTPUT_RELAY_4.2 NC_NO_RELAY_4.3
N$31
  Bottom 0.61: OUTPUT_RELAY_4.3 NC_NO_RELAY_4.1
N$32
  Bottom 0.61: OUTPUT_RELAY_5.1 SUPPLY_RELAY_5.2
N$33
  Bottom 0.61: OUTPUT_RELAY_9.3 NC_NO_RELAY_9.1
N$34
  Bottom 0.61: OUTPUT_RELAY_5.2 280.67,234.95 NC_NO_RELAY_5.3
N$35
  Bottom 0.61: OUTPUT_RELAY_10.1 278.13,144.78 276.86,146.05 SUPPLY_RELAY_10.2
N$36
  Bottom 0.61: OUTPUT_RELAY_5.3 280.67,229.87 NC_NO_RELAY_5.1
N$37
  Bottom 0.61: OUTPUT_RELAY_6.1 280.67,222.25 SUPPLY_RELAY_6.2
N$38
  Bottom 0.61: NC_NO_RELAY_6.3 OUTPUT_RELAY_6.2
N$39
  Bottom 0.61: OUTPUT_RELAY_10.2 NC_NO_RELAY_10.3
N$40
  Bottom 0.61: OUTPUT_RELAY_6.3 NC_NO_RELAY_6.1
N$41
  Bottom 0.61: OUTPUT_RELAY_10.3 NC_NO_RELAY_10.1
N$42
  Bottom 0.61: SUPPLY_RELAY_7.2 280.67,203.2 OUTPUT_RELAY_7.1
N$43
  Bottom 0.61: OUTPUT_RELAY_7.2 NC_NO_RELAY_7.3
N$44
  Bottom 0.61: SUPPLY_RELAY_11.2 280.67,127 OUTPUT_RELAY_11.1
N$45
  Bottom 0.61: OUTPUT_RELAY_11.2 NC_NO_RELAY_11.3
N$46
  Bottom 0.61: OUTPUT_RELAY_7.3 NC_NO_RELAY_7.1
N$47
  Bottom 0.61: SUPPLY_RELAY_8.2 280.67,184.15 OUTPUT_RELAY_8.1
N$48
  Bottom 0.61: OUTPUT_RELAY_8.2 NC_NO_RELAY_8.3
N$49
  Bottom 0.61: OUTPUT_RELAY_11.3 NC_NO_RELAY_11.1
N$50
  Bottom 0.61: OUTPUT_RELAY_8.3 NC_NO_RELAY_8.1
N$51
  Bottom 0.305: MOSFET1.3 157.73,309.63
  Bottom 1.016: MOSFET1.3 157.99,309.88 175.26,309.88 184.15,318.77 MOSFET_1.1
  Bottom 1.27: MOSFET_SUPPLY_1.2 151.13,294.64 157.48,300.99 MOSFET1.3
N$52
  Bottom 1.016: MOSFET1.4 156.72,313.69 171.45,313.69 179.07,321.31 MOSFET_1.2
N$53
  Top 1.27: MOSFET_2.1 166.37,278.13 157.48,269.24 MOSFET2.3
  Bottom 1.27: MOSFET_SUPPLY_2.2 153.67,250.19 157.48,254 MOSFET2.3
N$54
  Top 1.27: MOSFET2.4 152.4,269.24 161.29,278.13 MOSFET_2.2
N$55
  Bottom 0.813: MOSFET3.3 131.06,309.63
  Bottom 1.27: MOSFET_SUPPLY_3.2 127,294.64 131.06,298.7 131.06,309.63 | MOSFET3.3 142.75,321.31 146.05,321.31 149.86,325.12 MOSFET_3.1
N$56
  Bottom 1.27: MOSFET3.4 142.75,326.39 MOSFET_3.2
N$57
  Top 1.27: MOSFET4.3 130.81,270.51 133.35,273.05 133.35,303.53 137.16,307.34 137.16,313.69 132.08,318.77 MOSFET_4.1
  Bottom 1.27: MOSFET_SUPPLY_4.2 125.73,250.19 130.81,255.27 MOSFET4.3
N$58
  Bottom 0.61: SUPPLY_RELAY_12.2 280.67,107.95 OUTPUT_RELAY_12.1
N$59
  Top 1.27: MOSFET4.4 125.73,271.78 130.81,276.86 130.81,304.8 134.62,308.61 134.62,311.15 127,318.77 MOSFET_4.2
N$60
  Bottom 0.61: NC_NO_RELAY_12.3 OUTPUT_RELAY_12.2
N$61
  Bottom 0.61: NC_NO_RELAY_12.1 OUTPUT_RELAY_12.3
N$62
  Bottom 1.27: MOSFET_SUPPLY_5.2 96.52,294.64 104.14,302.26 MOSFET5.3 114.3,319.53 MOSFET_5.1
N$63
  Bottom 0.61: SUPPLY_RELAY_13.2 280.67,88.9 OUTPUT_RELAY_13.1
N$64
  Bottom 0.61: OUTPUT_RELAY_13.2 NC_NO_RELAY_13.3
N$65
  Bottom 1.27: MOSFET5.4 109.22,319.53 MOSFET_5.2
N$66
  Bottom 0.61: OUTPUT_RELAY_13.3 NC_NO_RELAY_13.1
N$67
  Bottom 0.61: SUPPLY_RELAY_14.2 280.67,69.85 OUTPUT_RELAY_14.1
N$68
  Top 1.27: MOSFET_6.1 97.79,320.04 100.33,317.5 105.41,317.5 110.49,312.42 110.49,304.8 106.68,300.99 106.68,271.78 104.14,269.24 MOSFET6.3
  Bottom 1.27: MOSFET_SUPPLY_6.2 99.06,250.19 104.14,255.27 MOSFET6.3
N$69
  Bottom 0.61: OUTPUT_RELAY_14.2 NC_NO_RELAY_14.3
N$70
  Bottom 0.61: OUTPUT_RELAY_14.3 NC_NO_RELAY_14.1
N$71
  Top 1.27: MOSFET6.4 99.06,271.78 104.14,276.86 104.14,302.26 107.95,306.07 107.95,311.15 104.14,314.96 96.52,314.96 92.71,318.77 MOSFET_6.2
N$72
  Bottom 0.61: SUPPLY_RELAY_15.2 280.67,50.8 OUTPUT_RELAY_15.1
N$73
  Bottom 0.61: OUTPUT_RELAY_15.2 NC_NO_RELAY_15.3
N$74
  Bottom 0.305: MOSFET7.3 78.74,309.88
  Bottom 1.27: MOSFET_SUPPLY_7.2 73.66,294.64 78.74,299.72 MOSFET7.3 78.74,325.12 MOSFET_7.1
N$75
  Bottom 1.27: MOSFET_7.2 73.66,325.12 MOSFET7.4
N$76
  Top 1.27: MOSFET8.3 78.74,261.62 69.85,270.51 69.85,299.72 62.23,307.34 MOSFET_8.1
  Bottom 1.27: MOSFET8.3 78.74,255.27 73.66,250.19 MOSFET_SUPPLY_8.2
N$77
  Top 1.27: MOSFET8.4 66.04,268.73 66.04,298.45 58.42,306.07 58.42,325.12 MOSFET_8.2
N$78
  Bottom 1.27: MOSFET_SUPPLY_9.2 48.26,294.64 54.61,300.99 MOSFET9.3 54.61,316.23 MOSFET_9.1
N$79
  Bottom 1.27: MOSFET_9.2 49.53,316.23 MOSFET9.4
N$80
  Top 1.27: MOSFET_10.1 26.67,317.5 43.18,300.99 43.18,271.27 MOSFET10.3
  Bottom 1.27: MOSFET_SUPPLY_10.2 48.26,250.19 53.34,255.27 MOSFET10.3
N$81
  Top 1.27: MOSFET_10.2 21.59,318.77 40.64,299.72 40.64,268.73 MOSFET10.4
N$82
  Bottom 0.61: OUTPUT_RELAY_15.3 NC_NO_RELAY_15.1
N$83
  Bottom 0.61: SUPPLY_RELAY_16.2 280.67,31.75 OUTPUT_RELAY_16.1
N$85
  Bottom 0.61: OUTPUT_RELAY_16.2 NC_NO_RELAY_16.3
N$88
  Bottom 0.61: OUTPUT_RELAY_16.3 NC_NO_RELAY_16.1
N$91
  Bottom 0.61: OUTPUT_RELAY_17.1 SUPPLY_RELAY_17.2
N$94
  Bottom 0.61: OUTPUT_RELAY_17.2 184.15,12.7 NC_NO_RELAY_17.3
N$96
  Bottom 0.61: OUTPUT_RELAY_17.3 179.07,12.7 NC_NO_RELAY_17.1
N$97
  Bottom 0.61: SUPPLY_RELAY_18.2 OUTPUT_RELAY_18.1
N$98
  Bottom 0.61: NC_NO_RELAY_18.3 163.83,12.7 OUTPUT_RELAY_18.2
N$99
  Bottom 0.61: NC_NO_RELAY_18.1 158.75,12.7 OUTPUT_RELAY_18.3
N$100
  Bottom 0.61: SUPPLY_RELAY_19.2 OUTPUT_RELAY_19.1
N$101
  Bottom 0.61: NC_NO_RELAY_19.3 143.51,12.7 OUTPUT_RELAY_19.2
N$102
  Bottom 0.61: NC_NO_RELAY_19.1 138.43,12.7 OUTPUT_RELAY_19.3
N$103
  Bottom 0.61: SUPPLY_RELAY_20.2 OUTPUT_RELAY_20.1
N$104
  Bottom 0.61: NC_NO_RELAY_20.3 123.19,12.7 OUTPUT_RELAY_20.2
N$105
  Bottom 0.61: NC_NO_RELAY_20.1 118.11,12.7 OUTPUT_RELAY_20.3
N$106
  Bottom 0.61: SUPPLY_RELAY_21.2 OUTPUT_RELAY_21.1
N$107
  Bottom 0.61: NC_NO_RELAY_21.3 102.87,12.7 OUTPUT_RELAY_21.2
N$108
  Bottom 0.61: NC_NO_RELAY_21.1 97.79,12.7 OUTPUT_RELAY_21.3
N$109
  Bottom 0.61: SUPPLY_RELAY_22.2 OUTPUT_RELAY_22.1
N$110
  Bottom 0.61: NC_NO_RELAY_22.3 82.55,12.7 OUTPUT_RELAY_22.2
N$111
  Bottom 0.61: NC_NO_RELAY_22.1 77.47,12.7 OUTPUT_RELAY_22.3
N$112
  Bottom 0.61: SUPPLY_RELAY_23.2 OUTPUT_RELAY_23.1
N$113
  Bottom 0.61: NC_NO_RELAY_23.3 63.5,12.7 OUTPUT_RELAY_23.2
N$114
  Bottom 0.61: NC_NO_RELAY_23.1 58.42,12.7 OUTPUT_RELAY_23.3
N$115
  Bottom 0.61: SUPPLY_RELAY_24.2 OUTPUT_RELAY_24.1
N$116
  Bottom 0.61: OUTPUT_RELAY_24.2 44.45,12.7 NC_NO_RELAY_24.3
N$117
  Bottom 0.61: NC_NO_RELAY_24.1 39.37,12.7 OUTPUT_RELAY_24.3
N$120
  Bottom 1.27: S3.2 10.16,313.69 11.43,314.96 17.78,314.96 19.05,313.69 19.05,310.01 J1.PWR
OUT1
  Bottom 0.305: B1.14 166.37,137.16 167.64,138.43 167.64,243.84 177.8,254 RELAY_PIN_HEADER_1_8.9
OUT2
  Bottom 0.305: B1.15 167.64,134.62 170.18,137.16 170.18,242.57 179.07,251.46 RELAY_PIN_HEADER_1_8.8
OUT3
  Bottom 0.305: B1.16 171.45,132.08 173.99,134.62 173.99,241.3 181.61,248.92 RELAY_PIN_HEADER_1_8.7
OUT4
  Bottom 0.305: RELAY_PIN_HEADER_1_8.6 182.88,246.38 176.53,240.03 176.53,132.08 173.99,129.54 B1.17
OUT5
  Bottom 0.305: B1.18 175.26,127 179.07,130.81 179.07,237.49 185.42,243.84 RELAY_PIN_HEADER_1_8.5
OUT6
  Bottom 0.305: B1.19 176.53,124.46 181.61,129.54 181.61,236.22 186.69,241.3 RELAY_PIN_HEADER_1_8.4
OUT7
  Bottom 0.305: B1.23 144.78,105.41 146.05,104.14 162.56,104.14 184.15,125.73 184.15,234.95 187.96,238.76 RELAY_PIN_HEADER_1_8.3
OUT8
  Bottom 0.254: 142.24,105.41 B1.25
  Bottom 0.305: 142.24,105.41 144.78,102.87 165.1,102.87 186.69,124.46 186.69,233.68 189.23,236.22 RELAY_PIN_HEADER_1_8.2
OUT9
  Bottom 0.305: B1.27 139.7,105.41 143.51,101.6 167.64,101.6 173.99,107.95 RELAY_PIN_HEADER_9_16.9
OUT10
  Bottom 0.305: B1.29 137.16,104.14 142.24,99.06 167.64,99.06 173.99,105.41 RELAY_PIN_HEADER_9_16.8
OUT11
  Bottom 0.305: RELAY_PIN_HEADER_9_16.7 175.26,102.87 168.91,96.52 140.97,96.52 134.62,102.87 B1.31
OUT12
  Bottom 0.305: RELAY_PIN_HEADER_9_16.6 175.26,100.33 168.91,93.98 139.7,93.98 132.08,101.6 B1.33
OUT13
  Bottom 0.305: RELAY_PIN_HEADER_9_16.5 176.53,97.79 170.18,91.44 138.43,91.44 129.54,100.33 B1.35
OUT14
  Bottom 0.305: B1.37 127,100.33 138.43,88.9 171.45,88.9 177.8,95.25 RELAY_PIN_HEADER_9_16.4
OUT15
  Bottom 0.305: B1.39 124.46,100.33 137.16,87.63 173.99,87.63 179.07,92.71 RELAY_PIN_HEADER_9_16.3
OUT16
  Bottom 0.305: RELAY_PIN_HEADER_9_16.2 180.34,90.17 175.26,85.09 135.89,85.09 121.92,99.06 B1.41
OUT17
  Bottom 0.305: B1.43 120.65,107.95 RELAY_PIN_HEADER_17_24.9
OUT18
  Bottom 0.305: B1.45 118.11,107.95 RELAY_PIN_HEADER_17_24.8
OUT19
  Bottom 0.305: B1.47 115.57,107.95 RELAY_PIN_HEADER_17_24.7
OUT20
  Bottom 0.305: B1.49 113.03,107.95 RELAY_PIN_HEADER_17_24.6
OUT21
  Bottom 0.305: B1.A15 96.52,114.3 95.25,113.03 95.25,102.87 97.79,100.33 104.14,100.33 110.49,93.98 RELAY_PIN_HEADER_17_24.5
OUT22
  Bottom 0.305: B1.A14 96.52,116.84 92.71,113.03 92.71,102.87 97.79,97.79 102.87,97.79 107.95,92.71 RELAY_PIN_HEADER_17_24.4
OUT23
  Bottom 0.305: B1.A13 96.52,119.38 90.17,113.03 90.17,101.6 96.52,95.25 101.6,95.25 105.41,91.44 RELAY_PIN_HEADER_17_24.3
OUT24
  Bottom 0.305: RELAY_PIN_HEADER_17_24.2 102.87,90.17 100.33,92.71 96.52,92.71 88.9,100.33 88.9,115.57 95.25,121.92 B1.A12
PWM1
  Bottom 0.305: MOSFET1.1 156.21,279.4 166.37,269.24 166.37,149.86 163.83,147.32 B1.2
PWM2
  Bottom 0.305: B1.3 163.83,149.86 165.1,151.13 165.1,224.79 158.75,231.14 MOSFET2.1
PWM3
  Bottom 0.305: B1.4 162.56,152.4 163.83,153.67 163.83,220.98 157.48,227.33 144.78,227.33 135.89,236.22 135.89,273.05 129.54,279.4 MOSFET3.1
PWM4
  Bottom 0.305: B1.5 161.29,154.94 162.56,156.21 162.56,219.71 157.48,224.79 133.35,224.79 MOSFET4.1
PWM5
  Bottom 0.305: B1.6 160.02,157.48 161.29,158.75 161.29,218.44 157.48,222.25 120.65,222.25 107.95,234.95 107.95,273.05 101.6,279.4 MOSFET5.1
PWM6
  Bottom 0.305: B1.7 158.75,160.02 160.02,161.29 160.02,217.17 157.48,219.71 111.76,219.71 MOSFET6.1
PWM7
  Bottom 0.305: B1.8 157.48,163.83 158.75,165.1 158.75,215.9 157.48,217.17 105.41,217.17 82.55,240.03 82.55,273.05 76.2,279.4 MOSFET7.1
PWM8
  Bottom 0.305: B1.9 156.21,166.37 157.48,167.64 157.48,214.63 156.21,215.9 104.14,215.9 88.9,231.14 MOSFET8.1
PWM9
  Bottom 0.305: B1.11 154.94,171.45 156.21,172.72 156.21,212.09 154.94,213.36 99.06,213.36 85.09,227.33 62.23,227.33 57.15,232.41 57.15,274.32 52.07,279.4 MOSFET9.1
PWM10
  Bottom 0.305: MOSFET10.1 55.88,224.79 85.09,224.79 99.06,210.82 152.4,210.82 153.67,209.55 153.67,175.26 152.4,173.99 B1.12
RST
  Bottom 0.203: ETHERNET_PINS.2 88.9,199.39 87.63,198.12 87.63,180.34 95.25,172.72 B1.RESET
SCK
  Bottom 0.203: ETHERNET_PINS.3 93.98,201.93 106.68,189.23 B1.52
SCL
  Top 0.305: U$3.J1.3 85.09,175.26 93.98,184.15 125.73,184.15 140.97,168.91 140.97,123.19 144.78,119.38 B1.21
SCS
  Top 0.203: B1.10 149.86,168.91 152.4,171.45 152.4,189.23 137.16,204.47 ETHERNET_PINS.4
SDA
  Top 0.305: U$3.J1.2 85.09,177.8 92.71,185.42 127,185.42 142.24,170.18 142.24,124.46 144.78,121.92 B1.20
TEST
  Top 0.305: S1.1 90.6,187.96 127,187.96 138.43,176.53 B1.13
VCC.1  (2 unrouted)
VCC.2  (2 unrouted)

## Text on the board
Top: VCC | VCC | VCC | VCC | VCC | VCC | VCC | VCC | VCC | VCC | + | 12V / COM / 5V | + | 5V / COM / 12V | + | + | GND | + | INTELLIGENT | ENTERTAINMENT | + | MISO | MOSI | SCS | SCK | + | RST | + | + | + | + | GND | 1.GND / 8.5V | + | + | 1.GND / 8.5V | GND | + | 1.GND / 8.5V | + | 1.GND / 8.5V | + | 1.GND / 8.5V | + | + | + | + | + | + | + | +